# Altium schematic sheet CAN.SchDoc
size A
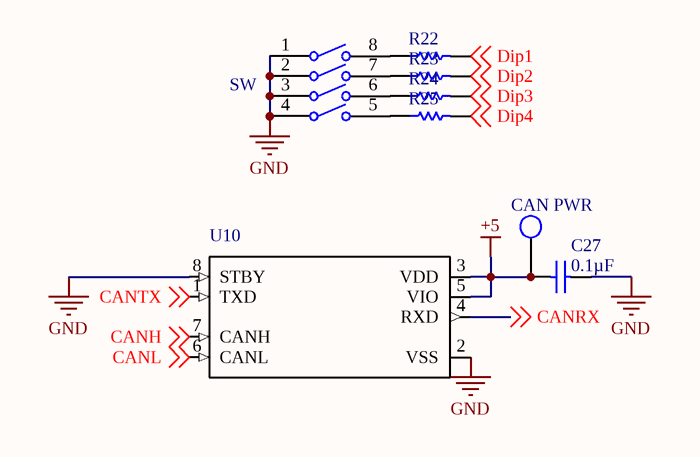
[diagram p0: CAN.SchDoc]

## Parts
C27  Capacitance: 0.1µF  [Cap 0805]  (hidden comment: Capacitor 0805)
CAN_PWR  Test Point  [Test Point Through-hole]  (value not drawn)
R22  Resistor 0805  [RESC0805(2012)_N]  (value not drawn)
R23  Resistor 0805  [RESC0805(2012)_N]  (value not drawn)
R24  Resistor 0805  [RESC0805(2012)_N]  (value not drawn)
R25  Resistor 0805  [RESC0805(2012)_N]  (value not drawn)
SW  TDA04H0SB1  [CKCP-TDA04H0SB1R_V]  (value not drawn)
U10  MCP2562-E/SN  [SOIC127P600X175-8N]  (value not drawn)

## Nets
+5: C27.1 CAN_PWR.1 U10.3(VDD) U10.5(VIO)
GND: C27.2 SW.1 SW.2 SW.3 SW.4 U10.2(VSS) U10.8(STBY)
CANH: U10.7(CANH) ; off-sheet CANH
CANL: U10.6(CANL) ; off-sheet CANL
CANRX: U10.4(RXD) ; off-sheet CANRX
CANTX: U10.1(TXD) ; off-sheet CANTX
Dip1: R22.2 ; off-sheet Dip1
Dip2: R23.2 ; off-sheet Dip2
Dip3: R24.2 ; off-sheet Dip3
Dip4: R25.2 ; off-sheet Dip4
NetR22_1: R22.1 SW.8
NetR23_1: R23.1 SW.7
NetR24_1: R24.1 SW.6
NetR25_1: R25.1 SW.5

## Library data of the parts
C27 = Capacitor 0805: Standard Capacitor; Manufacturer: AVX; Tolerance (%): ±10%; Dielectric: X5R; Rated Voltage: 10V; Datasheet Version: 05/2016; Manufacturer URL: http://www.avx.com/; Package Description: 2-Pin Surface Mount Device, Body 2.01 x 1.25 mm; Mounting Technology: SurfaceMount; Case Size/Dimension: 0805; Package Reference: 0805; Datasheet URL: http://datasheets.avx.com/cx5r.pdf
R22-R25 = Resistor 0805: Generic 0805 Resistor; Tolerance: 5 %; Case-Metric: 2012; Case-EIA: 0805; Power: 0.125 W; Value: 120R; Technology: SMT
SW = Dip Switch Array SMD Half-Pitch: Ultra-Miniature Surface Mount Half-Pitch DIP Switch, 25 mA, 24 V, -40 to 85 degC, 8-Pin SMD, RoHS, Tube; Contact Current Rating: 100 mA; Throw Configuration: SPST; Voltage Rating (DC): 24 V; Max Contact Resistance: 100 mohm; Max Current Rating: 25 mA; REACH SVHC: No SVHC; DatasheetVersion: 02/2016; Case\Package: DIP; Package Quantity: 70; Lead Pitch: 1.27 mm; Contact Plating: Gold; Packaging: Rail/Tube; Contact Finish: Gold; Mount: Surface Mount; Height: 2.3 mm; Contact Material: Copper; Max Operating Temperature: 85 degC; Max Voltage Rating (DC): 24 V; ComponentLink1URL: https://www.ckswitches.com/media/1328/tda.pdf; PackageDescription: 8-Pin Surface Mount Device, Body 6.21 x 6.2 mm, Pitch 1.27 mm; Radiation Hardening: No; ComponentLink1Description: Datasheet Link; Current Rating: 100 mA; RoHSCompliant: true; PackageReference: TDA04H0SB1R; Min Operating Temperature: -40 degC; Pins: 4; Mounting Technology: Surface Mount; Length: 6.21 mm; Digi-Key_Part_Number: CKN9065-ND; ComponentLink2Description: Digi-Key_Purchase_URL; ComponentLink2URL: https://www.digikey.com/en/products/detail/c-k/TDA04H0SB1/1083755
U10 = CAN Tranceiver: Microchip MCP2562-E/SN, CAN Transceiver 1MBps 1-channel IEC 61000-4-2, 8-Pin SOIC; Price: None; MF: Microchip; SnapEDA_Link: https://www.snapeda.com/parts/MCP2562-E/SN/Microchip/view-part/?ref=snap; MP: MCP2562-E/SN; Availability: Unavailable; Package: SO-8 Microchip; Value: *; Digi-Key_Part_Number: MCP2562T-E/SNCT-ND; ComponentLink1Description: Digi-Key_Purchase_URL; ComponentLink1URL: https://www.digikey.com/en/products/detail/microchip-technology/MCP2562T-E-SN/5011025; ComponentLink2Description: Datasheet_Link; ComponentLink2URL: http://www.microchip.com/mymicrochip/filehandler.aspx?ddocname=en561044